# EAGLE design solenoid valve (EAGLE 9.6.2)

## Sheet 1 of 4: photorelay0
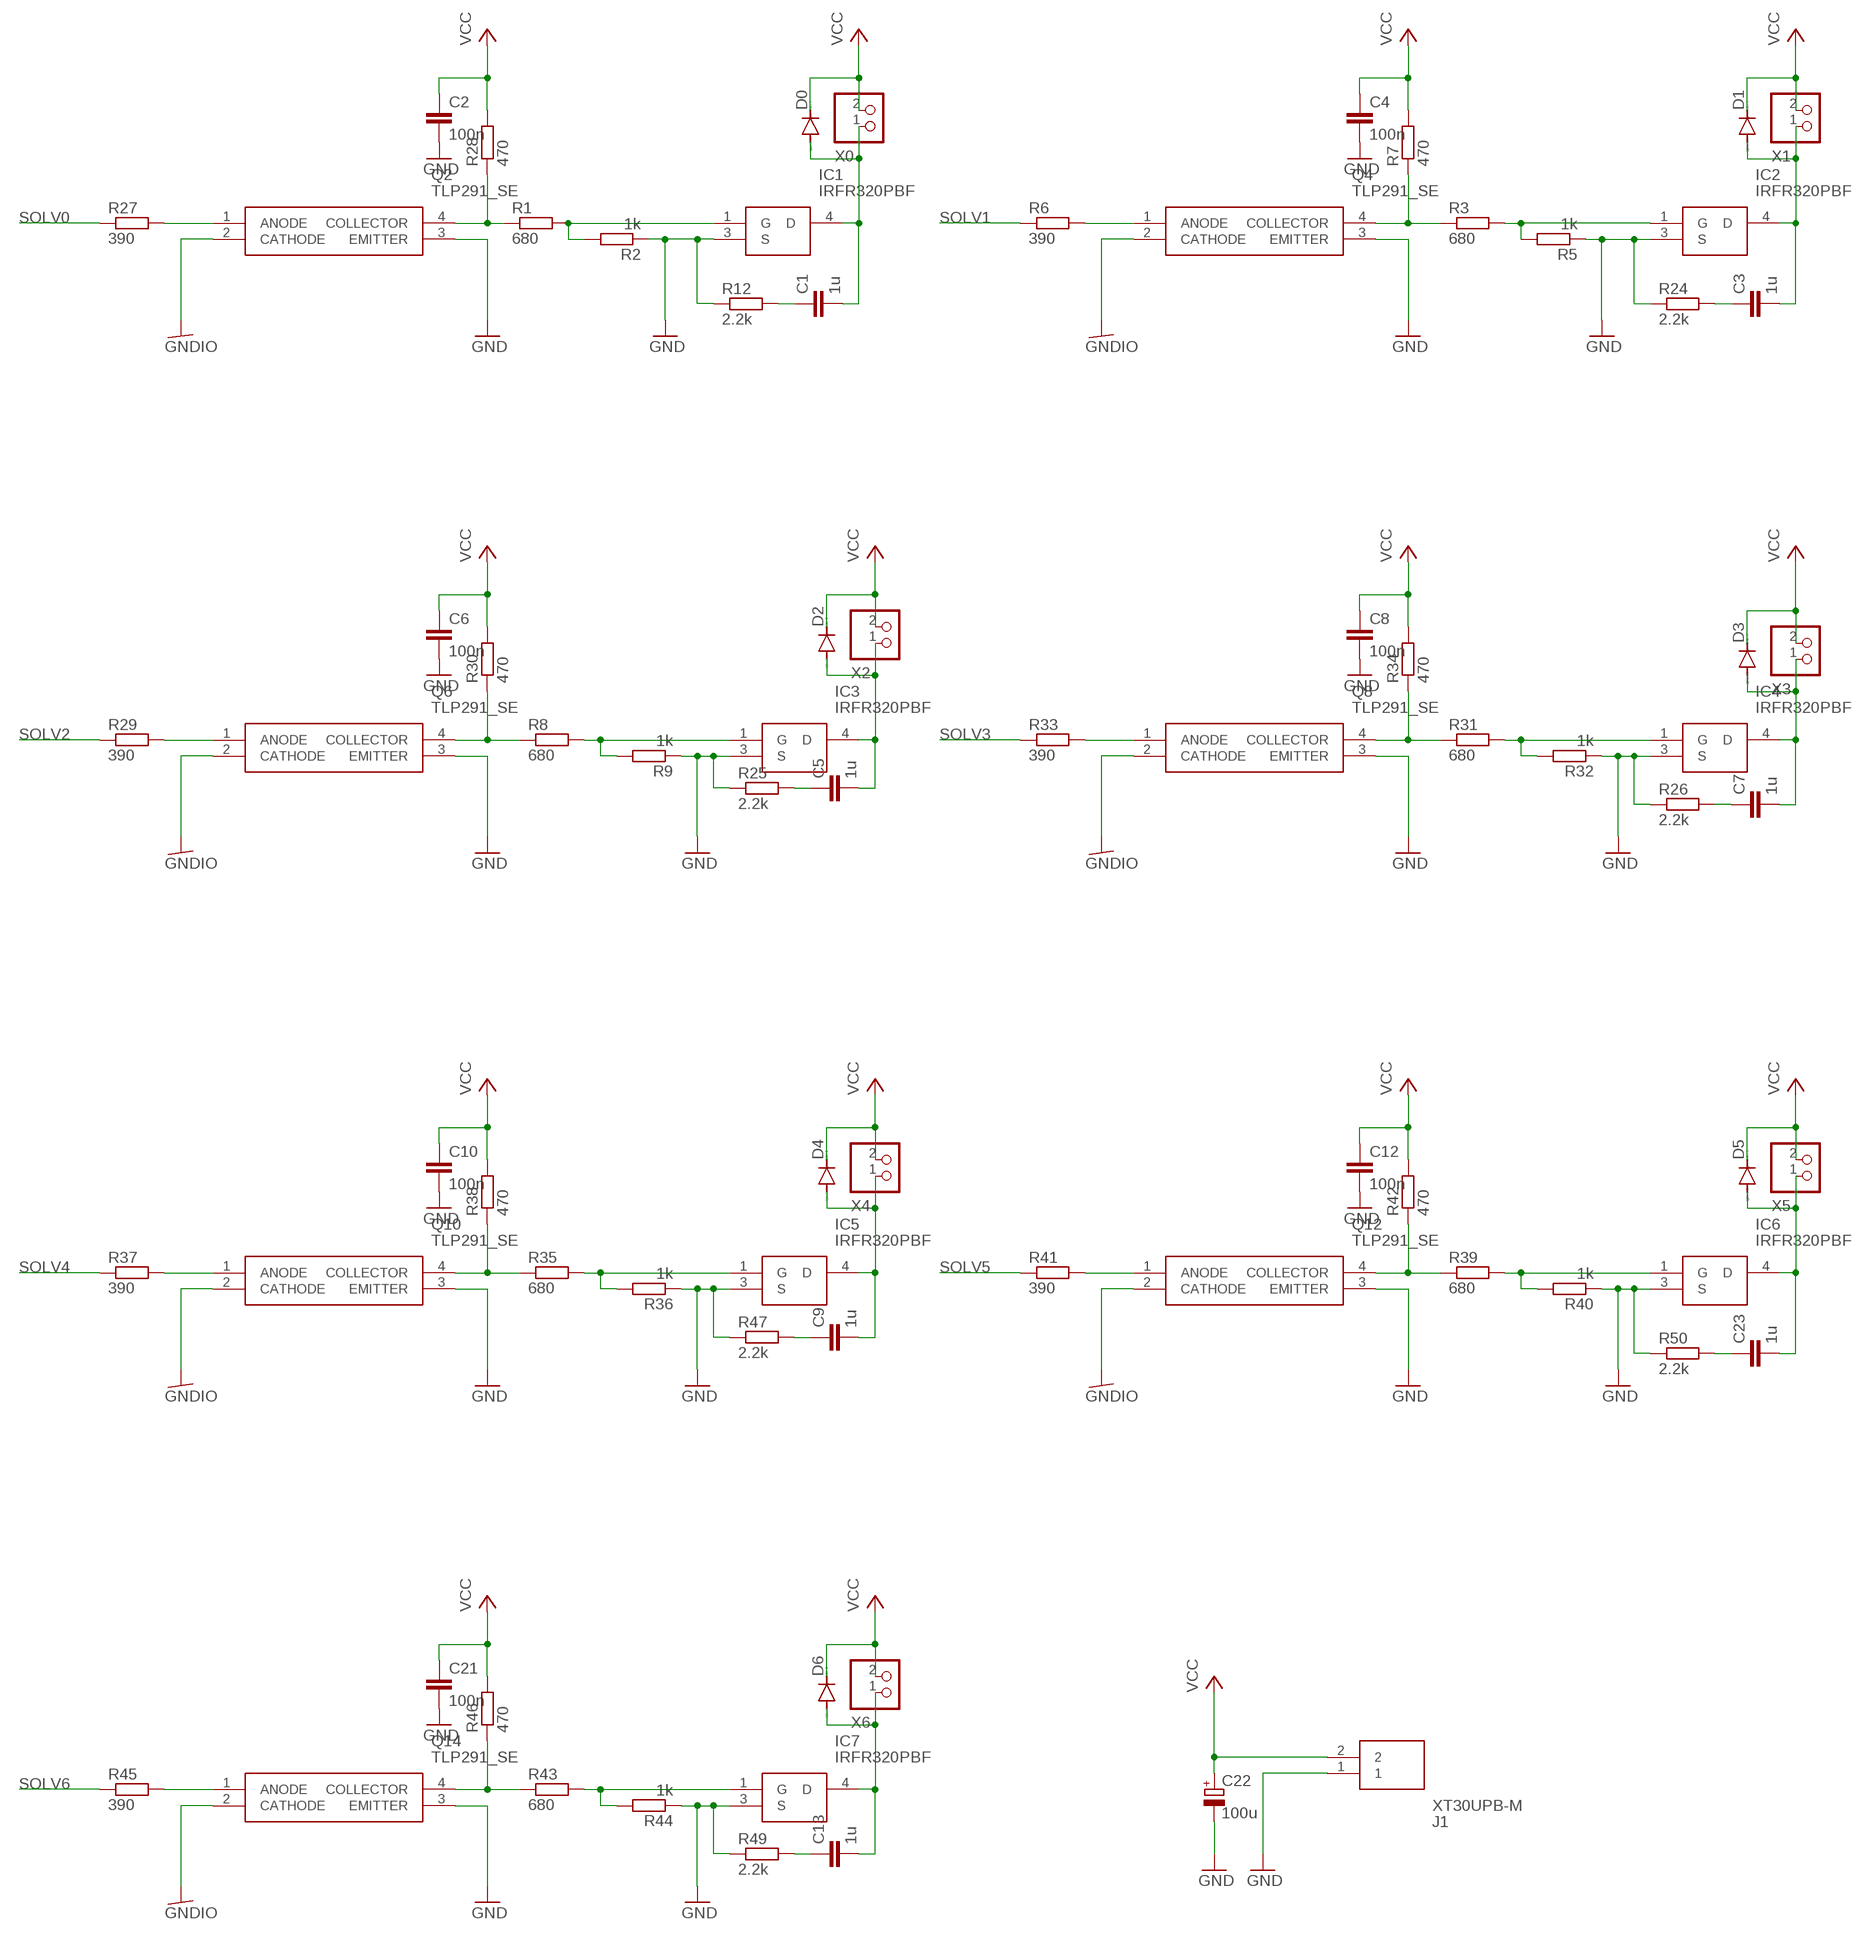
[diagram p0: schematic, sheet 1]

### Parts
C1  1u  C-EUC0603  [C0603]
C2  100n  C-EUC0603  [C0603]
C3  1u  C-EUC0603  [C0603]
C4  100n  C-EUC0603  [C0603]
C5  1u  C-EUC0603  [C0603]
C6  100n  C-EUC0603  [C0603]
C7  1u  C-EUC0603  [C0603]
C8  100n  C-EUC0603  [C0603]
C9  1u  C-EUC0603  [C0603]
C10  100n  C-EUC0603  [C0603]
C12  100n  C-EUC0603  [C0603]
C13  1u  C-EUC0603  [C0603]
C21  100n  C-EUC0603  [C0603]
C22  100u  CPOL-EUE2-5  [E2-5]
C23  1u  C-EUC0603  [C0603]
D0  DIODE-SOD123  [SOD123]
D1  DIODE-SOD123  [SOD123]
D2  DIODE-SOD123  [SOD123]
D3  DIODE-SOD123  [SOD123]
D4  DIODE-SOD123  [SOD123]
D5  DIODE-SOD123  [SOD123]
D6  DIODE-SOD123  [SOD123]
IC1  IRFR320PBF  [TO228P990X238-3N]
IC2  IRFR320PBF  [TO228P990X238-3N]
IC3  IRFR320PBF  [TO228P990X238-3N]
IC4  IRFR320PBF  [TO228P990X238-3N]
IC5  IRFR320PBF  [TO228P990X238-3N]
IC6  IRFR320PBF  [TO228P990X238-3N]
IC7  IRFR320PBF  [TO228P990X238-3N]
J1  XT30UPB-M  [SHDR2W160P0X500_1X2_1020X520X1]
Q2  TLP291_SE  [SOIC127P700X230-4N]
Q4  TLP291_SE  [SOIC127P700X230-4N]
Q6  TLP291_SE  [SOIC127P700X230-4N]
Q8  TLP291_SE  [SOIC127P700X230-4N]
Q10  TLP291_SE  [SOIC127P700X230-4N]
Q12  TLP291_SE  [SOIC127P700X230-4N]
Q14  TLP291_SE  [SOIC127P700X230-4N]
R1  680  R-EU_R0603  [R0603]
R2  1k  R-EU_R0603  [R0603]
R3  680  R-EU_R0603  [R0603]
R5  1k  R-EU_R0603  [R0603]
R6  390  R-EU_R0603  [R0603]
R7  470  R-EU_R0603  [R0603]
R8  680  R-EU_R0603  [R0603]
R9  1k  R-EU_R0603  [R0603]
R12  2.2k  R-EU_R0603  [R0603]
R24  2.2k  R-EU_R0603  [R0603]
R25  2.2k  R-EU_R0603  [R0603]
R26  2.2k  R-EU_R0603  [R0603]
R27  390  R-EU_R0603  [R0603]
R28  470  R-EU_R0603  [R0603]
R29  390  R-EU_R0603  [R0603]
R30  470  R-EU_R0603  [R0603]
R31  680  R-EU_R0603  [R0603]
R32  1k  R-EU_R0603  [R0603]
R33  390  R-EU_R0603  [R0603]
R34  470  R-EU_R0603  [R0603]
R35  680  R-EU_R0603  [R0603]
R36  1k  R-EU_R0603  [R0603]
R37  390  R-EU_R0603  [R0603]
R38  470  R-EU_R0603  [R0603]
R39  680  R-EU_R0603  [R0603]
R40  1k  R-EU_R0603  [R0603]
R41  390  R-EU_R0603  [R0603]
R42  470  R-EU_R0603  [R0603]
R43  680  R-EU_R0603  [R0603]
R44  1k  R-EU_R0603  [R0603]
R45  390  R-EU_R0603  [R0603]
R46  470  R-EU_R0603  [R0603]
R47  2.2k  R-EU_R0603  [R0603]
R49  2.2k  R-EU_R0603  [R0603]
R50  2.2k  R-EU_R0603  [R0603]
X0  S2B-XASK-1  [S2B-XASK-1]
X1  S2B-XASK-1  [S2B-XASK-1]
X2  S2B-XASK-1  [S2B-XASK-1]
X3  S2B-XASK-1  [S2B-XASK-1]
X4  S2B-XASK-1  [S2B-XASK-1]
X5  S2B-XASK-1  [S2B-XASK-1]
X6  S2B-XASK-1  [S2B-XASK-1]

### Nets
GND: C2.2 C4.2 C6.2 C8.2 C10.2 C12.2 C21.2 C22.- IC1.3(S) IC2.3(S) IC3.3(S) IC4.3(S) IC5.3(S) IC6.3(S) IC7.3(S) J1.1 Q2.3(EMITTER) Q4.3(EMITTER) Q6.3(EMITTER) Q8.3(EMITTER) Q10.3(EMITTER) Q12.3(EMITTER) Q14.3(EMITTER) R2.1 R5.1 R9.1 R12.1 R24.1 R25.1 R26.1 R32.1 R36.1 R40.1 R44.1 R47.1 R49.1 R50.1
GNDIO: Q2.2(CATHODE) Q4.2(CATHODE) Q6.2(CATHODE) Q8.2(CATHODE) Q10.2(CATHODE) Q12.2(CATHODE) Q14.2(CATHODE) ; also sheet 2,3,4
N$1: IC2.1(G) R3.2 R5.2
N$2: C3.2 D1.A IC2.4(D) X1.1
N$3: Q2.4(COLLECTOR) R1.1 R28.1
N$4: Q4.1(ANODE) R6.2
N$5: Q4.4(COLLECTOR) R3.1 R7.1
N$6: IC1.1(G) R1.2 R2.2
N$7: C1.2 D0.A IC1.4(D) X0.1
N$8: IC3.1(G) R8.2 R9.2
N$20: Q2.1(ANODE) R27.2
N$23: C5.2 D2.A IC3.4(D) X2.1
N$24: Q6.1(ANODE) R29.2
N$25: Q6.4(COLLECTOR) R8.1 R30.1
N$26: C7.2 D3.A IC4.4(D) X3.1
N$27: C9.2 D4.A IC5.4(D) X4.1
N$28: IC4.1(G) R31.2 R32.2
N$29: C3.1 R24.2
N$30: C23.1 R50.2
N$31: C23.2 D5.A IC6.4(D) X5.1
N$32: C5.1 R25.2
N$33: IC7.1(G) R43.2 R44.2
N$34: Q8.1(ANODE) R33.2
N$35: Q8.4(COLLECTOR) R31.1 R34.1
N$36: IC5.1(G) R35.2 R36.2
N$39: Q10.1(ANODE) R37.2
N$40: Q10.4(COLLECTOR) R35.1 R38.1
N$41: IC6.1(G) R39.2 R40.2
N$43: Q12.1(ANODE) R41.2
N$44: Q12.4(COLLECTOR) R39.1 R42.1
N$46: C13.2 D6.A IC7.4(D) X6.1
N$47: Q14.1(ANODE) R45.2
N$48: Q14.4(COLLECTOR) R43.1 R46.1
N$49: C7.1 R26.2
N$51: C9.1 R47.2
N$55: C13.1 R49.2
N$56: C1.1 R12.2
SOLV0: R27.1 ; also sheet 2
SOLV1: R6.1 ; also sheet 2
SOLV2: R29.1 ; also sheet 2
SOLV3: R33.1 ; also sheet 2
SOLV4: R37.1 ; also sheet 2
SOLV5: R41.1 ; also sheet 2
SOLV6: R45.1 ; also sheet 2
VCC: C2.1 C4.1 C6.1 C8.1 C10.1 C12.1 C21.1 C22.+ D0.C D1.C D2.C D3.C D4.C D5.C D6.C J1.2 R7.2 R28.2 R30.2 R34.2 R38.2 R42.2 R46.2 X0.2 X1.2 X2.2 X3.2 X4.2 X5.2 X6.2

## Sheet 2 of 4: mcu
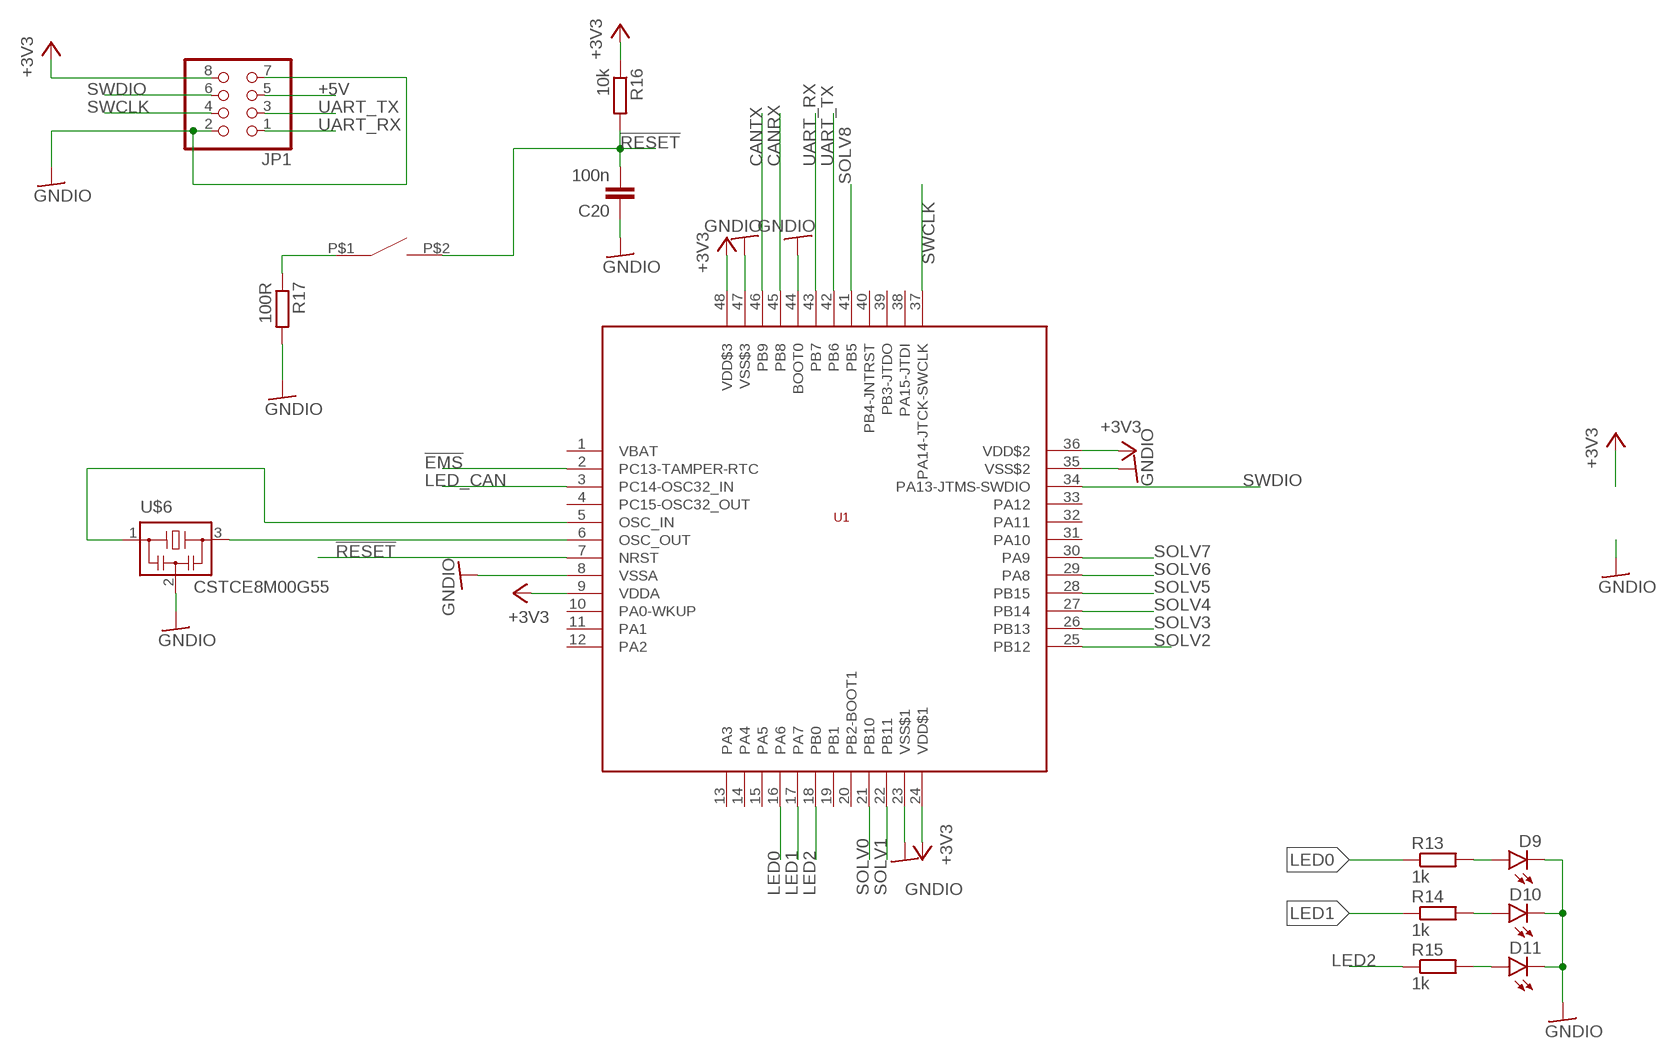
[diagram p1: schematic, sheet 2]

### Parts
C20  100n  C-EUC0603  [C0603]
D9  LEDCHIPLED_0805  [CHIPLED_0805]
D10  LEDCHIPLED_0805  [CHIPLED_0805]
D11  LEDCHIPLED_0805  [CHIPLED_0805]
JP1  PINHD-2X4  [2X04]
R13  1k  R-EU_R0603  [R0603]
R14  1k  R-EU_R0603  [R0603]
R15  1k  R-EU_R0603  [R0603]
R16  10k  R-EU_R0603  [R0603]
R17  100R  R-EU_R0603  [R0603]
SW1  SWITCH_TACTILETOP  [SWITCH_TACTILE_3X6]
U1  STM32F103C8  [LQFP48]
U$6  CSTCE8M00G55  [CSTCE8M00G55]

### Nets
!EMS: U1.2(PC13-TAMPER-RTC) ; also sheet 3
!RESET: C20.2 R16.2 SW1.P$2 U1.7(NRST)
+3V3: JP1.8 R16.1 U1.9(VDDA) U1.24(VDD$1) U1.36(VDD$2) U1.48(VDD$3) ; also sheet 4
+5V: JP1.5 ; also sheet 3,4
CANRX: U1.45(PB8) ; also sheet 3
CANTX: U1.46(PB9) ; also sheet 3
GNDIO: C20.1 D9.C D10.C D11.C JP1.2 JP1.7 R17.2 U1.8(VSSA) U1.23(VSS$1) U1.35(VSS$2) U1.44(BOOT0) U1.47(VSS$3) U$6.2 ; also sheet 1,3,4
LED0: R13.1 U1.16(PA6)
LED1: R14.1 U1.17(PA7)
LED2: R15.1 U1.18(PB0)
LED_CAN: U1.3(PC14-OSC32_IN) ; also sheet 3
N$9: D10.A R14.2
N$10: D9.A R13.2
N$11: U1.6(OSC_OUT) U$6.3
N$16: R17.1 SW1.P$1
N$19: U1.5(OSC_IN) U$6.1
N$21: D11.A R15.2
SOLV0: U1.21(PB10) ; also sheet 1
SOLV1: U1.22(PB11) ; also sheet 1
SOLV2: U1.25(PB12) ; also sheet 1
SOLV3: U1.26(PB13) ; also sheet 1
SOLV4: U1.27(PB14) ; also sheet 1
SOLV5: U1.28(PB15) ; also sheet 1
SOLV6: U1.29(PA8) ; also sheet 1
SOLV7: U1.30(PA9)
SOLV8: U1.41(PB5)
SWCLK: JP1.4 U1.37(PA14-JTCK-SWCLK)
SWDIO: JP1.6 U1.34(PA13-JTMS-SWDIO)
UART_RX: JP1.1 U1.43(PB7)
UART_TX: JP1.3 U1.42(PB6)
Unconnected: U1.1(VBAT) U1.4(PC15-OSC32_OUT) U1.10(PA0-WKUP) U1.11(PA1) U1.12(PA2) U1.13(PA3) U1.14(PA4) U1.15(PA5) U1.19(PB1) U1.20(PB2-BOOT1) U1.31(PA10) U1.32(PA11) U1.33(PA12) U1.38(PA15-JTDI) U1.39(PB3-JTDO) U1.40(PB4-JNTRST)

## Sheet 3 of 4: can
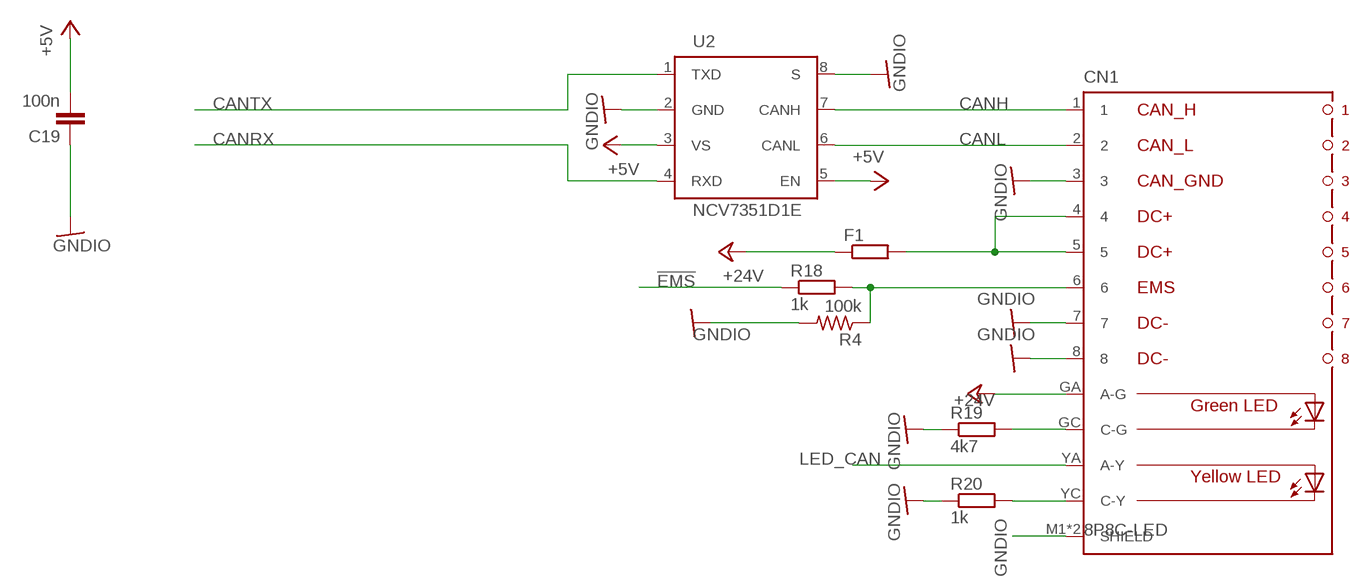
[diagram p2: schematic, sheet 3]

### Parts
C19  100n  C-EUC0603  [C0603]
CN1  8P8C-LED  [8P8C-LED]
F1  R-EU_R1206  [R1206]
R4  100k  R-US_R0603  [R0603]
R18  1k  R-EU_R0603  [R0603]
R19  4k7  R-EU_R0603  [R0603]
R20  1k  R-EU_R0603  [R0603]
U2  NCV7351D1E  [SO08]

### Nets
!EMS: R18.1 ; also sheet 2
+5V: C19.2 U2.3(VS) U2.5(EN) ; also sheet 2,4
+24V: CN1.GA(A-G) F1.1 ; also sheet 4
CANH: CN1.1 U2.7(CANH)
CANL: CN1.2 U2.6(CANL)
CANRX: U2.4(RXD) ; also sheet 2
CANTX: U2.1(TXD) ; also sheet 2
GNDIO: C19.1 CN1.3 CN1.7 CN1.8 CN1.M1(SHIELD) CN1.M2(SHIELD) R4.2 R19.1 R20.1 U2.2(GND) U2.8(S) ; also sheet 1,2,4
LED_CAN: CN1.YA(A-Y) ; also sheet 2
N$12: CN1.4 CN1.5 F1.2
N$18: CN1.YC(C-Y) R20.2
N$22: CN1.GC(C-G) R19.2
N$38: CN1.6 R4.1 R18.2

## Sheet 4 of 4: power suply
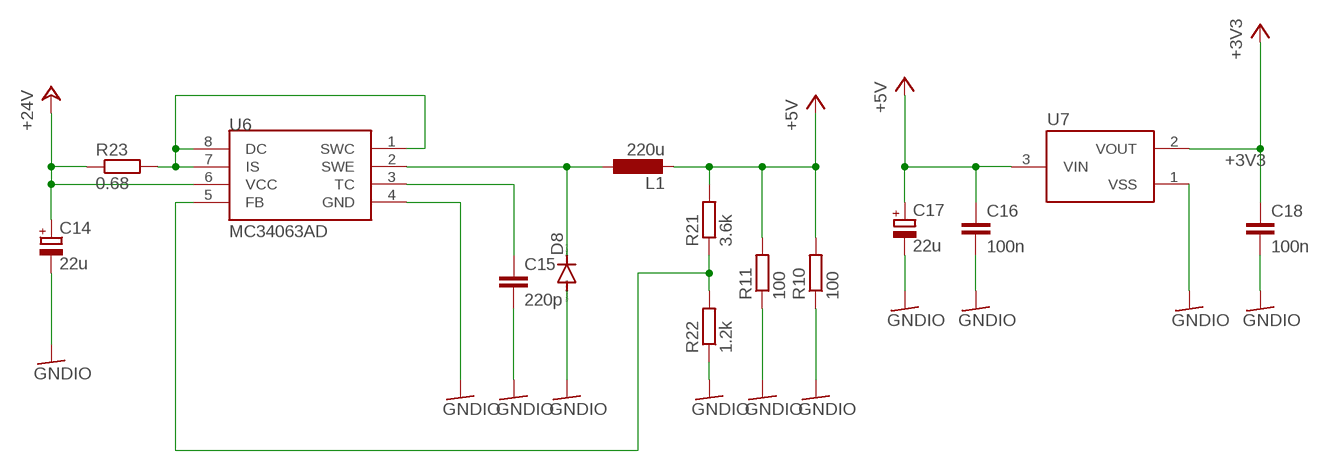
[diagram p3: schematic, sheet 4]

### Parts
C14  22u  CPOL-EUE2-5  [E2-5]
C15  220p  C-EUC0603  [C0603]
C16  100n  C-EUC0603  [C0603]
C17  22u  CPOL-EUE2-5  [E2-5]
C18  100n  C-EUC0603  [C0603]
D8  DIODE-SOD123  [SOD123]
L1  220u  L5852  [L5852]
R10  100  R-EU_R0603  [R0603]
R11  100  R-EU_R0603  [R0603]
R21  3.6k  R-EU_R0603  [R0603]
R22  1.2k  R-EU_R0603  [R0603]
R23  0.68  R-EU_R1206  [R1206]
U6  MC34063AD  [SOIC8]
U7  XC6206  [SOT95P240X110-3]

### Nets
+3V3: C18.1 U7.2(VOUT) ; also sheet 2
+5V: C16.1 C17.+ L1.P$2 R10.2 R11.2 R21.2 U7.3(VIN) ; also sheet 2,3
+24V: C14.+ R23.1 U6.6(VCC) ; also sheet 3
GNDIO: C14.- C15.2 C16.2 C17.- C18.2 D8.A R10.1 R11.1 R22.1 U6.4(GND) U7.1(VSS) ; also sheet 1,2,3
N$13: R23.2 U6.1(SWC) U6.7(IS) U6.8(DC)
N$14: D8.C L1.P$1 U6.2(SWE)
N$15: C15.1 U6.3(TC)
N$17: R21.1 R22.2 U6.5(FB)

## Library data of the parts
C1-C10 C12 C13 C15 C21 C23 = rcl:C-EU: CAPACITOR, European symbol; SPICEPREFIX: C
C14 C17 = rcl:CPOL-EU: POLARIZED CAPACITOR, European symbol
C16 C18-C20 = rcl:C-EU: CAPACITOR, European symbol
C22 = rcl:CPOL-EU: POLARIZED CAPACITOR, European symbol; SPICEPREFIX: C
CN1 = con-rj45:8P8C-LED: generic 8P8C connector with two LED's; OC_FARNELL: unknown; OC_NEWARK: unknown
D0 D1-D6 D8 = diode:DIODE-: DIODE
D9-D11 = led:LED: LED OSRAM: - CHIPLED LG R971, LG N971, LY N971, LG Q971, LY Q971, LO R971, LY R971 LH N974, LH R974 LS Q976, LO Q976, LY Q976 LO Q996 - Hyper CHIPLED LW Q18S LB Q993, LB Q99A, LB R99A - SideLED LS A670, LO A670, LY A670, LG A670, LP A670 LB A673, LV A673, LT A673, LW A673 LH A674 LY A675 LS A676, LA A676, LO A676, LY A676, LW A676 LS A679, LY A679, LG A679 - Hyper Micro SIDELED® LS Y876, LA Y876, LO Y876, LY Y876 LT Y87S - SmartLED LW L88C, LW L88S LB L89C, LB L89S, LG L890 LS L89K, LO L89K, LY L89K LS L896, LA L896, LO L896, LY L896 - TOPLED LS T670, LO T670, LY T670, LG T670, LP T670 LSG T670, LSP T670, LSY T670, LOP T670, LYG T670 LG T671, LOG T671, LSG T671 LB T673, LV T673, LT T673, LW T673 LH T674 LS T676, LA T676, LO T676, LY T676, LB T676, LH T676, LSB T676, LW T676 LB T67C, LV T67C, LT T67C, LS T67K, LO T67K, LY T67K, LW E67C LS E67B, LA E67B, LO E67B, LY E67B, LB E67C, LV E67C, LT E67C LW T67C LS T679, LY T679, LG T679 LS T770, LO T770, LY T770, LG T770, LP T770 LB T773, LV T773, LT T773, LW T773 LH T774 LS E675, LA E675, LY E675, LS T675 LS T776, LA T776, LO T776, LY T776, LB T776 LHGB T686 LT T68C, LB T68C - Hyper Mini TOPLED® LB M676 - Mini TOPLED Santana® LG M470 LS M47K, LO M47K, LY M47K Source: http://www.osram.convergy.de LUXEON: - LUMILED® LXK2-PW12-R00, LXK2-PW12-S00, LXK2-PW14-U00, LXK2-PW14-V00 LXK2-PM12-R00, LXK2-PM12-S00, LXK2-PM14-U00 LXK2-PE12-Q00, LXK2-PE12-R00, LXK2-PE12-S00, LXK2-PE14-T00, LXK2-PE14-U00 LXK2-PB12-K00, LXK2-PB12-L00, LXK2-PB12-M00, LXK2-PB14-N00, LXK2-PB14-P00, LXK2-PB14-Q00 LXK2-PR12-L00, LXK2-PR12-M00, LXK2-PR14-Q00, LXK2-PR14-R00 LXK2-PD12-Q00, LXK2-PD12-R00, LXK2-PD12-S00 LXK2-PH12-R00, LXK2-PH12-S00 LXK2-PL12-P00, LXK2-PL12-Q00, LXK2-PL12-R00 Source: www.luxeon.com KINGBRIGHT: KA-3528ASYC Source: www.kingbright.com
F1 R1-R3 R5-R12 R18-R47 R49 R50 = rcl:R-EU_: RESISTOR, European symbol; SPICEPREFIX: R
IC1-IC7 = SamacSys_Parts:IRFR320PBF: IRFR320PBF, N-channel MOSFET Transistor, 3.1 A 400 V, 3-Pin D-PAK Source: Datasheet <http://www.vishay.com/docs/91273/sihfr320.pdf>; ARROW_PART_NUMBER: IRFR320PBF; ARROW_PRICE-STOCK: https://www.arrow.com/en/products/irfr320pbf/vishay?region=nac; DESCRIPTION: IRFR320PBF, N-channel MOSFET Transistor, 3.1 A 400 V, 3-Pin D-PAK; HEIGHT: mm; MANUFACTURER_NAME: Vishay; MANUFACTURER_PART_NUMBER: IRFR320PBF; MOUSER_PART_NUMBER: 844-IRFR320PBF; MOUSER_PRICE-STOCK: https://www.mouser.co.uk/ProductDetail/Vishay-Semiconductors/IRFR320PBF?qs=iXwvDCb7I7gFL0QusxUOmg%3D%3D
J1 = SamacSys_Parts:XT30UPB-M: Socket; DC supply; XT30; male; PIN: 2; on PCBs; THT; Colour: yellow Source: Datasheet <https://www.tme.eu/Document/4acc913878197f8c2e30d4b8cdc47230/XT30UPB SPEC.pdf>; DESCRIPTION: Socket; DC supply; XT30; male; PIN: 2; on PCBs; THT; Colour: yellow; HEIGHT: 10.7mm; MANUFACTURER_NAME: Amass; MANUFACTURER_PART_NUMBER: XT30UPB-M
JP1 = pinhead:PINHD-2X4: PIN HEADER
L1 = l_ysk:L5852
Q2 Q4 Q6 Q8 Q10 Q12 Q14 = SamacSys_Parts:TLP291_SE: TOSHIBA - TLP291(SE - OPTOCOUPLER, PHOTOTRANS, 3.75KV, SOIC-4 Source: Datasheet <https://toshiba.semicon-storage.com/info/docget.jsp?did=14152&prodName=TLP291(SE>; ARROW_PART_NUMBER: TLP291(SE; ARROW_PRICE-STOCK: https://www.arrow.com/en/products/tlp291-se/toshiba?region=nac; DESCRIPTION: TOSHIBA - TLP291(SE - OPTOCOUPLER, PHOTOTRANS, 3.75KV, SOIC-4; HEIGHT: 2.3mm; MANUFACTURER_NAME: Toshiba; MANUFACTURER_PART_NUMBER: TLP291(SE; MOUSER_PART_NUMBER: 757-TLP291SE; MOUSER_PRICE-STOCK: https://www.mouser.co.uk/ProductDetail/Toshiba/TLP291SE?qs=d%252BuLRCbWxrq6GSE9DY16yA%3D%3D
R4 = rcl:R-US_: RESISTOR, American symbol; SPICEPREFIX: R
R13-R17 = rcl:R-EU_: RESISTOR, European symbol
SW1 = switch-tactile:SWITCH_TACTILE
U1 = stm32_mcu:STM32F103C8: STMicroelectronics STM32F103C8 Mainstream Performance line, ARM Cortex-M3 MCU with 64 Kbytes Flash, 72 MHz CPU, motor control, USB and CAN references: datasheet <https://www.st.com/resource/en/datasheet/stm32f103c8.pdf> product page <https://www.st.com/ja/microcontrollers/stm32f103c8.html>
U2 = on-semi:NCV7351D1E: High Speed CAN Transceiver Source: NCV7351-D.PDF <http://www.onsemi.com/PowerSolutions/document/NCV7351-D.PDF>
U6 = mc34063:MC34063
U7 = torex:XC6206
U$6 = resonator:CSTCE8M00G55
X0 X1-X6 = jst-xa:S2B-XASK-1: Wire-to-Board 2.5mm pitch top mount connector Source: http://www.jst-mfg.com/product/pdf/jpn/XA1.pdf http://www.jst-mfg.com/product/detail.php?series=272

## Board
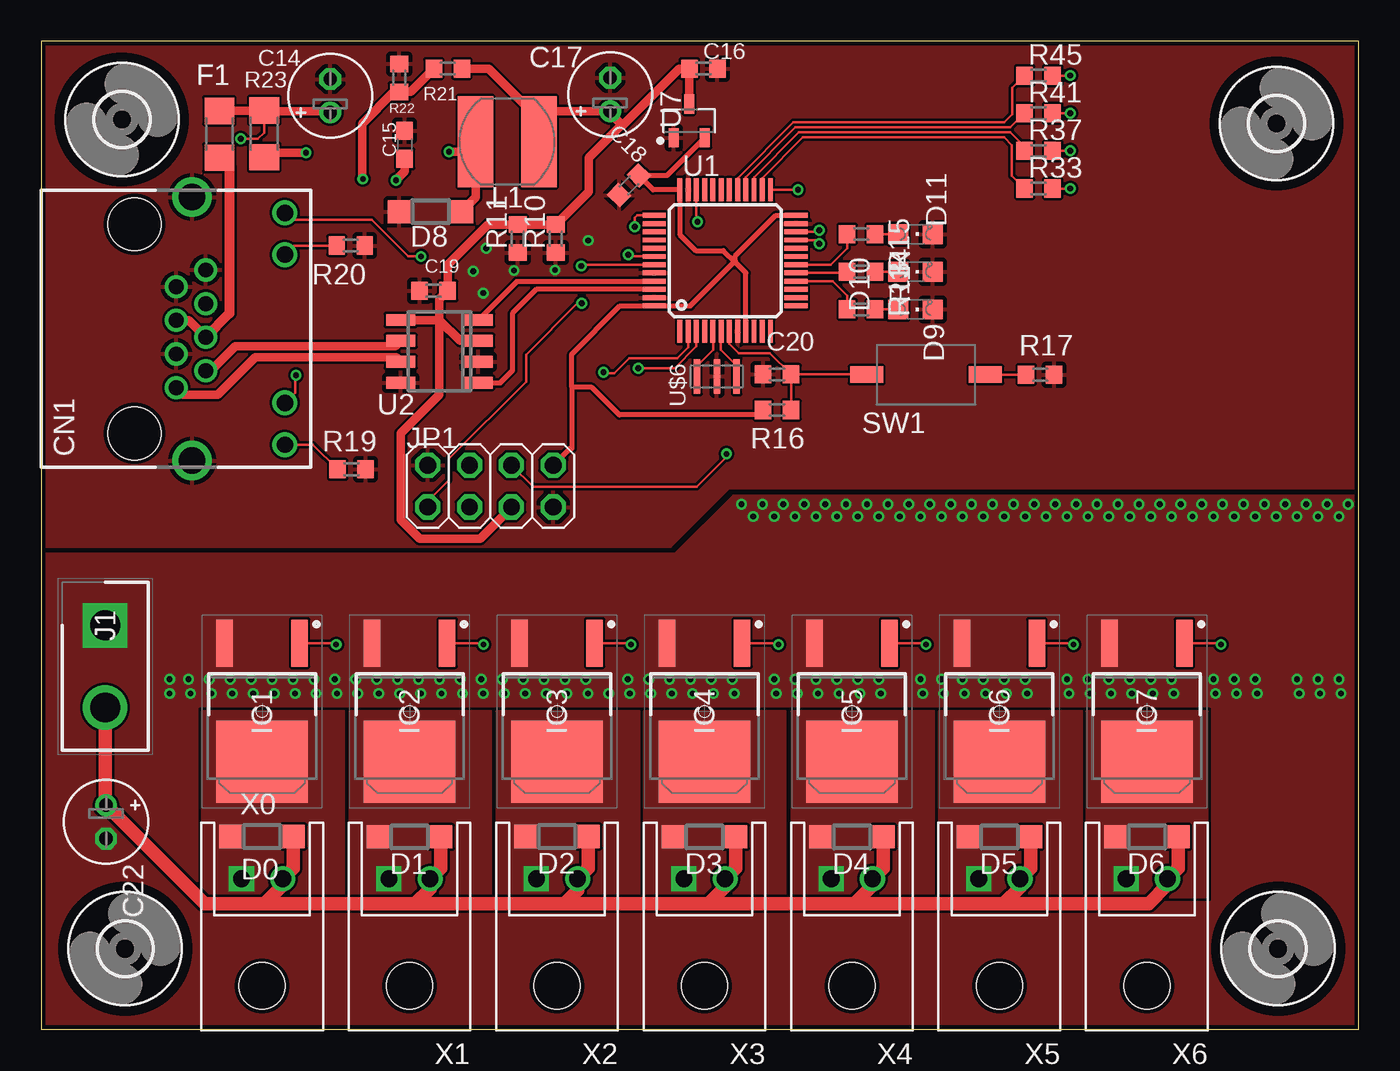
[diagram p4: board, top side]
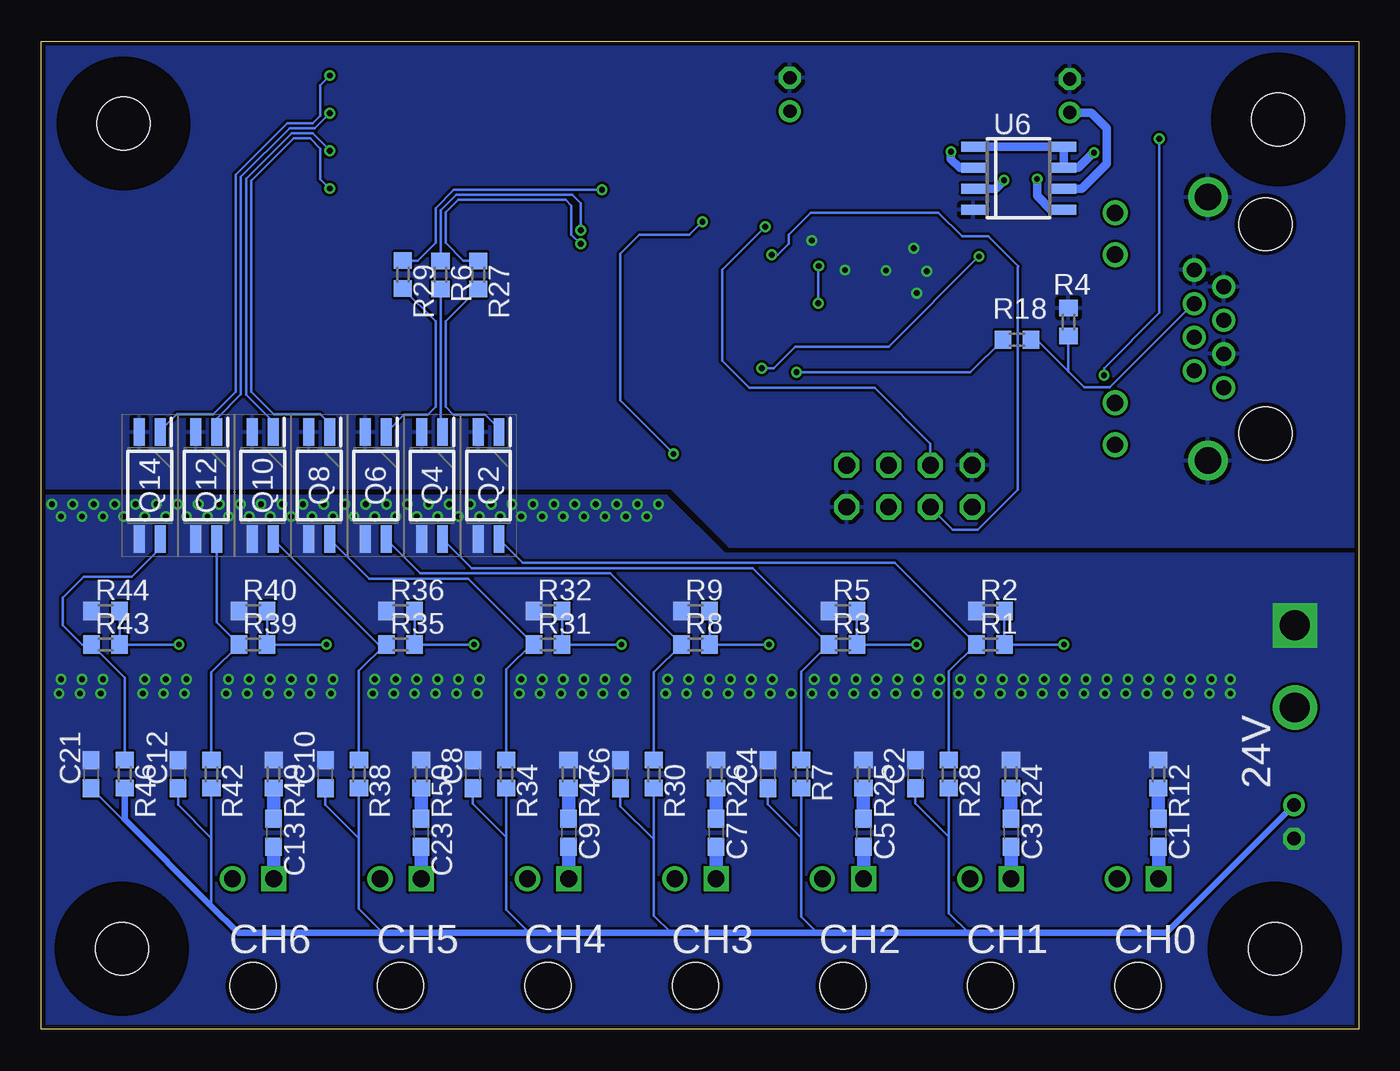
[diagram p5: board, bottom side, seen from below]

Size 80 x 60 mm. Coordinates in mm from the lower left corner, seen from the top.
Outline: 0,0 80,0 80,60 0,60 0,0
Copper layers (1*16): Top 0.035mm / dielectric 1.5mm / Bottom 0.035mm
Design rules "SeeedStudio_2layer_DRU_no_angle_20140221": minimum track width 6mil, minimum drill 12mil, track to track 6mil, track to pad 6mil, pad to pad 6mil, via to via 6mil, smd to smd 0mil, copper to edge 10mil, drill to drill 10mil, minimum pad ring 10mil, minimum via ring 6mil, stop-mask expansion 2mil, vias tented up to drill 100mil, thermal gap 10mil

### Footprints (pad centres in the part's own frame; a part is rotated, then mirrored left to right if it is on the bottom)
C0603 = smd 1.1 x 1: 1 -0.85,0; 2 0.85,0
E2-5 = drill 0.813 pad 1.27: + -1.016,0 | drill 0.813 pad 1.27 octagon: - 1.016,0
C0603' = smd 1 x 1.1: 1 -0.85,0; 2 0.85,0
8P8C-LED = drill 0.9 pad 1.3: 1 3.57,-3.81; 2 2.55,-2.03; 3 1.53,-3.81; 4 0.51,-2.03; 5 -0.51,-3.81; 6 -1.53,-2.03; 7 -2.55,-3.81; 8 -3.57,-2.03 | drill 1 pad 1.422: GA 4.5,2.78; GC 7.04,2.78; YA -7.04,2.78; YC -4.5,2.78 | drill 1.6 pad 2.184: M1 -8,-2.85; M2 8,-2.85 | hole 3.2: 6.35,-6.35; -6.35,-6.35
SOD123 = smd 1.4 x 1.4: A 1.9,0; C -1.9,0
CHIPLED_0805 = smd 1.2 x 1.2: A 0,-1.05; C 0,1.05
R1206 = smd 1.6 x 1.803: 1 -1.422,0; 2 1.422,0
TO228P990X238-3N = smd 2.85 x 1: 1 -4.15,2.28; 3 -4.15,-2.28 | smd 5 x 5.55: 4 3.05,0
SHDR2W160P0X500_1X2_1020X520X1 = drill 1.8 pad 2.7 square: 1 0,0 | drill 1.8 pad 2.7: 2 5,0
2X04 = drill 1.016 octagon: 1 -3.81,-1.27; 2 -3.81,1.27; 3 -1.27,-1.27; 4 -1.27,1.27; 5 1.27,-1.27; 6 1.27,1.27; 7 3.81,-1.27; 8 3.81,1.27
L5852 = smd 2.15 x 5.5: P$1 1.925,0; P$2 -1.925,0
SOIC127P700X230-4N = smd 1.65 x 0.65: 1 -3.25,0.635; 2 -3.25,-0.635; 3 3.25,-0.635; 4 3.25,0.635
R0603 = smd 1 x 1.1: 1 -0.85,0; 2 0.85,0
SWITCH_TACTILE_3X6 = smd 2 x 1: P$1 -3.6,0; P$2 3.6,0
LQFP48 = smd 1.4 x 0.3: 1 -4.3,2.75; 2 -4.3,2.25; 3 -4.3,1.75; 4 -4.3,1.25; 5 -4.3,0.75; 6 -4.3,0.25; 7 -4.3,-0.25; 8 -4.3,-0.75; 9 -4.3,-1.25; 10 -4.3,-1.75; 11 -4.3,-2.25; 12 -4.3,-2.75; 25 4.3,-2.75; 26 4.3,-2.25; 27 4.3,-1.75; 28 4.3,-1.25; 29 4.3,-0.75; 30 4.3,-0.25; 31 4.3,0.25; 32 4.3,0.75; 33 4.3,1.25; 34 4.3,1.75; 35 4.3,2.25; 36 4.3,2.75 | smd 0.3 x 1.4: 13 -2.75,-4.3; 14 -2.25,-4.3; 15 -1.75,-4.3; 16 -1.25,-4.3; 17 -0.75,-4.3; 18 -0.25,-4.3; 19 0.25,-4.3; 20 0.75,-4.3; 21 1.25,-4.3; 22 1.75,-4.3; 23 2.25,-4.3; 24 2.75,-4.3; 37 2.75,4.3; 38 2.25,4.3; 39 1.75,4.3; 40 1.25,4.3; 41 0.75,4.3; 42 0.25,4.3; 43 -0.25,4.3; 44 -0.75,4.3; 45 -1.25,4.3; 46 -1.75,4.3; 47 -2.25,4.3; 48 -2.75,4.3
SO08 = smd 0.72 x 1.78: 1 -1.905,-2.35; 2 -0.635,-2.35; 3 0.635,-2.35; 4 1.905,-2.35; 5 1.905,2.35; 6 0.635,2.35; 7 -0.635,2.35; 8 -1.905,2.35
SOIC8 = smd 0.6 x 1.5: 1 -1.905,-2.75; 2 -0.635,-2.75; 3 0.635,-2.75; 4 1.905,-2.75; 5 1.905,2.75; 6 0.635,2.75; 7 -0.635,2.75; 8 -1.905,2.75
SOT95P240X110-3 = smd 1.18 x 0.609: 1 -1.024,0.95; 2 -1.024,-0.95; 3 1.024,0
3,2 = hole 3.2: 0,0
CSTCE8M00G55 = smd 0.4 x 2.1: 1 -1.2,0; 2 0,0; 3 1.2,0
S2B-XASK-1 = drill 1.016 square: 1 1.25,0 | drill 1.016: 2 -1.25,0 | hole 2.8: 0,6.5

### Placement (x,y rotation side)
C1  12.17,11.94 270 bottom
C2  26.92,15.49 90 bottom
C3  21.12,11.94 270 bottom
C4  35.88,15.49 90 bottom
C5  30.07,11.94 270 bottom
C6  44.83,15.49 90 bottom
C7  39.03,11.94 270 bottom
C8  53.78,15.49 90 bottom
C9  47.98,11.94 270 bottom
C10  62.74,15.49 90 bottom
C12  71.69,15.49 90 bottom
C13  65.89,11.94 270 bottom
C14  17.55,56.69 90 top
C15  22.07,53.71 90 top
C16  100n  [C0603']  40.21,58.34 0 top
C17  34.54,56.76 90 top
C18  100n  [C0603']  35.69,51.25 225 top
C19  100n  [C0603']  23.83,44.85 0 top
C20  100n  [C0603']  44.68,39.77 0 top
C21  76.96,15.49 90 bottom
C22  3.94,12.6 270 top
C23  56.93,11.94 270 bottom
CN1  12.01,42.54 270 top
D0  13.41,11.71 180 top
D1  22.36,11.69 180 top
D2  31.32,11.71 180 top
D3  40.27,11.69 180 top
D4  49.23,11.69 180 top
D5  58.18,11.69 180 top
D6  67.13,11.69 180 top
D8  23.65,49.65 180 top
D9  53.09,43.71 270 top
D10  53.09,46 270 top
D11  53.09,48.29 270 top
F1  10.82,54.35 270 top
IC1  13.41,19.3 270 top
IC2  22.36,19.3 270 top
IC3  31.32,19.3 270 top
IC4  40.27,19.3 270 top
IC5  49.23,19.3 270 top
IC6  58.18,19.3 270 top
IC7  67.13,19.3 270 top
J1  3.89,24.54 270 top
JP1  27.28,32.99 0 top
L1  28.3,53.89 180 top
Q2  52.83,33.02 270 bottom
Q4  56.26,33.02 270 bottom
Q6  59.69,33.02 270 bottom
Q8  63.12,33.02 270 bottom
Q10  66.55,33.02 270 bottom
Q12  69.98,33.02 270 bottom
Q14  73.41,33.02 270 bottom
R1  22.36,23.37 0 bottom
R2  22.36,25.4 0 bottom
R3  31.32,23.37 0 bottom
R4  17.63,42.94 90 bottom
R5  31.32,25.4 0 bottom
R6  55.75,45.81 270 bottom
R7  33.85,15.49 270 bottom
R8  40.27,23.37 0 bottom
R9  40.27,25.4 0 bottom
R10  31.24,48.01 90 top
R11  28.93,48.01 90 top
R12  12.17,15.49 270 bottom
R13  49.78,43.71 0 top
R14  49.78,46 0 top
R15  49.78,48.29 0 top
R16  44.68,37.61 0 top
R17  60.66,39.75 0 top
R18  20.75,41.88 0 bottom
R19  18.85,34 180 top
R20  18.8,47.59 180 top
R21  24.69,58.34 0 top
R22  21.74,57.78 270 top
R23  13.54,54.37 270 top
R24  21.12,15.49 270 bottom
R25  30.07,15.49 270 bottom
R26  39.03,15.49 270 bottom
R27  53.47,45.81 270 bottom
R28  24.89,15.49 270 bottom
R29  58.04,45.82 270 bottom
R30  42.8,15.49 270 bottom
R31  49.23,23.37 0 bottom
R32  49.23,25.4 0 bottom
R33  60.55,51.05 0 top
R34  51.75,15.49 270 bottom
R35  58.18,23.37 0 bottom
R36  58.18,25.4 0 bottom
R37  60.55,53.34 0 top
R38  60.71,15.49 270 bottom
R39  67.13,23.37 0 bottom
R40  67.13,25.4 0 bottom
R41  60.55,55.63 0 top
R42  69.66,15.49 270 bottom
R43  76.09,23.37 0 bottom
R44  76.09,25.4 0 bottom
R45  60.55,57.91 0 top
R46  74.93,15.49 270 bottom
R47  47.98,15.49 270 bottom
R49  65.89,15.49 270 bottom
R50  56.93,15.49 270 bottom
SW1  53.72,39.75 180 top
U1  41.53,46.68 90 top
U2  24.18,41.17 90 top
U6  20.65,51.68 270 bottom
U7  39.34,55.16 90 top
U$1  [3,2]  5.1,4.9 0 top
U$2  [3,2]  4.9,55.24 0 top
U$3  [3,2]  75,55 0 top
U$4  [3,2]  75.1,4.9 0 top
U$6  41.02,39.64 0 top
X0  13.41,9.15 180 top
X1  22.36,9.15 180 top
X2  31.32,9.15 180 top
X3  40.27,9.15 180 top
X4  49.23,9.15 180 top
X5  58.18,9.15 180 top
X6  67.13,9.15 180 top

### Tracks (layer width: path | path; a pad name or v marks a point on that pad's centre or on a via)
!EMS  (via drill 0.35)
  Top 0.152: v34.14,39.9 34.19,39.84 34.8,39.84 35.71,40.76 38.63,40.76 39.28,41.41 U1.2
  Bottom 0.152: v34.14,39.9 23.58,39.9 R18.1
!RESET
  Top 0.152: U1.7 41.78,41.64 42.35,41.06 44.23,41.06 C20.2 | C20.2 R16.2 | C20.2 50.1,39.77 SW1.P$2
+3V3
  Top 0.305: 42.14,46.57 41.42,47.29 39.74,47.29 38.77,48.26 U1.36 37.16,50.98 C18.1 38.01,51.85 U7.2 | 42.14,46.57 42.78,45.94 U1.9 | 42.14,46.66 39.41,43.93 U1.48 35.14,43.93 32.22,41.01 32.22,38.98 | 42.14,46.57 42.14,46.66 | 42.14,46.66 42.14,46.96 44.61,49.43 U1.24 | 32.22,38.98 33.43,38.98 35.1,37.3 43.52,37.3 R16.1 | 32.22,38.98 32.22,35.28 32.12,35.28 JP1.8
+5V
  Top 0.508: R21.2 27.16,58.34 30.22,55.28 L1.P$2 30.22,55.74 C17.+ 34.54,55.61 35.24,54.91 | U2.5 24.17,43.07 | 24.17,43.07 24.17,44.34 C19.2 24.68,46.42 27.11,48.86 R11.2 R10.2 33.25,50.86 33.25,52.93 35.24,54.91 | 24.17,43.07 24.16,43.08 24.16,38.53 21.82,36.19 21.82,30.95 22.99,29.79 26.67,29.79 28.55,31.67 JP1.5 | 24.17,43.07 25.44,41.8 U2.3 | 35.24,54.91 35.27,54.88 38.73,58.34 C16.1 39.36,56.2 U7.3
+24V  (via drill 0.35)
  Top 0.152: R23.1 13.54,54.45 13.16,54.07 v12.12,54.07 | v15.47,39.72 15.42,39.72 15.42,38.66 CN1.GA
  Top 0.508: F1.1 13.51,55.77 R23.1 13.59,55.74 17.48,55.74 C14.+
  Bottom 0.152: v12.12,54.07 12.12,43.5 15.47,40.15 v15.47,39.72
  Bottom 0.508: U6.6 16.81,51.05 15.3,52.56 15.3,54.71 16.26,55.67 C14.+
CANH
  Top 0.508: U2.7 21.55,40.81 12.99,40.81 10.73,38.55 8.62,38.55 CN1.1
CANL
  Top 0.508: CN1.2 10.29,39.99 11.77,41.47 21.5,41.47 U2.6
CANRX
  Top 0.305: U1.45 37.2,45.4 28.86,45.4 U2.4
CANTX
  Top 0.305: U1.46 30.06,44.93 28.61,43.48 28.61,40 27.88,39.26 U2.1
GND  (via drill 0.35)
  other vias: 7.8,21.26 8.94,21.26 10.21,21.26 11.48,21.26 12.75,21.26 14.02,21.26 15.29,21.26 16.56,21.26 17.83,21.26 19.1,21.26 20.37,21.26 21.64,21.26 22.91,21.26 24.18,21.26 25.45,21.26 26.72,21.26 27.99,21.26 29.26,21.26 30.53,21.26 31.8,21.26 33.07,21.26 35.61,21.26 36.88,21.26 38.15,21.26 39.42,21.26 40.69,21.26 41.96,21.26 44.5,21.26 45.77,21.26 47.04,21.26 48.31,21.26 49.58,21.26 50.85,21.26 53.39,21.26 54.66,21.26 55.93,21.26 57.2,21.26 58.47,21.26 59.74,21.26 62.28,21.26 63.55,21.26 64.82,21.26 66.09,21.26 67.36,21.26 68.63,21.26 71.17,21.26 72.44,21.26 73.71,21.26 76.25,21.26 77.52,21.26 78.79,21.26 7.8,20.4 9.07,20.4 10.34,20.4 11.61,20.4 12.88,20.4 14.15,20.4 15.42,20.4 16.69,20.4 17.96,20.4 19.23,20.4 20.5,20.4 21.77,20.4 23.04,20.4 24.31,20.4 25.58,20.4 26.85,20.4 28.12,20.4 29.39,20.4 30.66,20.4 31.93,20.4 33.2,20.4 34.47,20.4 35.74,20.4 37.01,20.4 38.28,20.4 39.55,20.4 40.82,20.4 42.09,20.4 44.63,20.4 45.9,20.4 47.17,20.4 48.44,20.4 49.71,20.4 50.98,20.4 53.52,20.4 54.79,20.4 56.06,20.4 57.33,20.4 58.6,20.4 59.87,20.4 62.41,20.4 63.68,20.4 64.95,20.4 66.22,20.4 67.49,20.4 68.76,20.4 71.3,20.4 72.57,20.4 73.84,20.4 76.38,20.4 42.52,31.88 43.79,31.88 45.06,31.88 46.33,31.88 47.6,31.88 48.87,31.88 50.14,31.88 51.41,31.88 52.68,31.88 53.95,31.88 55.22,31.88 56.49,31.88 57.76,31.88 59.03,31.88 60.3,31.88 61.57,31.88 62.84,31.88 64.11,31.88 65.38,31.88 66.65,31.88 67.92,31.88 69.19,31.88 70.46,31.88 71.73,31.88 73,31.88 74.27,31.88 75.54,31.88 76.81,31.88 78.08,31.88 79.35,31.88 43.23,31.14 44.5,31.14 45.77,31.14 47.04,31.14 48.31,31.14 49.58,31.14 50.85,31.14 52.12,31.14 53.39,31.14 54.66,31.14 55.93,31.14 57.2,31.14 58.47,31.14 59.74,31.14 61.01,31.14 62.28,31.14 63.55,31.14 64.82,31.14 66.09,31.14 67.36,31.14 68.63,31.14 69.9,31.14 71.17,31.14 72.44,31.14 73.71,31.14 74.98,31.14 76.25,31.14 77.52,31.14 78.79,31.14 77.65,20.4 78.92,20.4
  pour Top (rank 3, no thermals): 0,28.87 38.48,28.87 42.01,32.4 80.01,32.4 80.01,0 0,0
  pour Bottom (no thermals): 0,28.87 38.48,28.87 42.01,32.4 80.01,32.4 80.01,0 0,0
  pour Bottom (no thermals): 11.13,17.25 11.13,15.47 13.21,15.47 13.21,17.25
  pour Bottom (no thermals): 20.12,17.27 20.12,15.42 22.17,15.42 22.17,17.27
  pour Bottom (no thermals): 29.18,17.27 29.18,15.49 31.01,15.49 31.11,15.6 31.11,17.27
  pour Bottom (no thermals): 37.97,17.14 37.97,15.52 40.01,15.52 40.01,17.25 38.07,17.25
  pour Bottom (no thermals): 46.96,17.3 46.96,15.42 49,15.42 49,17.3
  pour Bottom (no thermals): 55.98,17.42 55.98,15.39 58.01,15.39 58.01,17.42
  pour Bottom (no thermals): 64.95,17.35 64.95,15.42 66.88,15.42 66.88,17.35
GNDIO  (via drill 0.35)
  other vias: 26.24,46.02 27.03,47.42 26.85,44.7 28.7,46.08 31.19,46.1 33.22,47.9
  pour Top: 80.01,59.99 0,59.99 0,29.3 38.23,29.3 41.78,32.86 80.01,32.86
  pour Bottom: 80.01,59.99 0,59.99 0,29.3 38.23,29.3 41.78,32.86 80.01,32.86
LED0
  Top 0.152: U1.16 48.06,45.43 48.93,44.55 R13.1
LED1
  Top 0.152: U1.17 48.86,45.93 R14.1
LED2
  Top 0.152: U1.18 47.94,46.43 48.93,47.42 R15.1
LED_CAN  (via drill 0.35)
  Top 0.152: CN1.YA 15.23,49.15 20.08,49.15 22.3,46.93 v23.06,46.93 | U1.3 39.78,41.46 38.47,40.15 v36.25,40.15
  Bottom 0.152: v23.06,46.93 28.55,41.44 34.22,41.44 35.51,40.15 v36.25,40.15
N$1  (via drill 0.35)
  Top 0.152: IC2.1 26.77,23.45 v26.86,23.37
  Bottom 0.152: v26.86,23.37 R3.2 R5.2
N$2
  Bottom 0.813: X1.1 C3.2
  pour Top (rank 2, no thermals): 27.3,19.3 18.72,19.3 18.72,8.03 27.3,8.03
N$3
  Bottom 0.152: Q2.4 50.75,28.32 28.17,28.32 23.24,23.39 | 23.24,23.39 R1.1 | R28.1 24.89,21.74 23.24,23.39
N$4
  Bottom 0.152: Q4.1 55.75,36.4 R6.2
N$5
  Bottom 0.152: Q4.4 53.85,27.99 36.79,27.99 R3.1 | R3.1 | R7.1 33.85,21.7 R3.1
N$6  (via drill 0.35)
  Top 0.152: IC1.1 17.82,23.45 v17.91,23.37
  Bottom 0.152: R1.2 | R1.2 v17.91,23.37 | R2.2 R1.2
N$7
  Bottom 0.813: X0.1 C1.2
  pour Top (rank 2, no thermals): 18.36,19.3 9.78,19.3 9.78,8.05 9.75,8.03 18.36,8.03
N$8  (via drill 0.35)
  Top 0.152: IC3.1 35.73,23.45 v35.81,23.37
  Bottom 0.152: v35.81,23.37 R8.2 R9.2
N$9
  Top 0.152: R14.2 D10.A
N$10
  Top 0.152: R13.2 D9.A
N$11
  Top 0.152: U$6.3 42.22,40.3 41.25,41.27 41.25,42.35 U1.6
N$12
  Top 0.508: CN1.4 8.96,43.05 CN1.5
  Top 0.61: F1.2 11.43,52.32 11.43,43.47 CN1.4
N$13  (via drill 0.35)
  Top 0.508: R23.2 13.82,53.23 v16.08,53.23
  Bottom 0.508: v16.08,53.23 16.12,53.23 17.04,52.32 U6.7 U6.8 U6.1
N$14  (via drill 0.35)
  Top 0.508: v24.77,53.28 25.76,53.28 L1.P$1 26.37,50.52 25.55,49.7 D8.C
  Bottom 0.508: v24.77,53.28 24.77,52.84 24.24,52.32 U6.2
N$15  (via drill 0.35)
  Top 0.508: C15.1 22.07,52.09 v21.54,51.55
  Bottom 0.508: U6.3 22.05,51.05 v21.54,51.55
N$16
  Top 0.152: SW1.P$1 R17.1
N$17  (via drill 0.35)
  Top 0.508: R21.1 22.43,56.93 R22.2 21.41,56.93 19.48,55 19.48,51.68 v19.53,51.63
  Bottom 0.508: U6.5 18.69,49.78 19.53,50.62 v19.53,51.63
N$18
  Top 0.152: CN1.YC 15.35,47.59 R20.2
N$19
  Top 0.152: U$6.1 39.82,40.3 40.79,41.27 40.79,42.36 U1.5
N$20
  Bottom 0.152: R27.2 55.45,42.98 55.45,37.8 54.98,37.32 53.05,37.32 52.2,36.47 Q2.1
N$21
  Top 0.152: R15.2 D11.A
N$22
  Top 0.152: R19.2 16.5,35.5 CN1.GC
N$23
  Bottom 0.813: X2.1 C5.2
  pour Top (rank 2, no thermals): 36.32,19.3 27.66,19.3 27.66,8.03 36.32,8.03
N$24
  Bottom 0.152: R29.2 56.06,42.99 56.06,37.8 56.53,37.32 57.98,37.32 59.03,36.27 Q6.1
N$25
  Bottom 0.152: Q6.4 56.97,27.69 45.44,27.69 R8.1 42.8,21.69 R30.1
N$26
  Bottom 0.813: X3.1 C7.2
  pour Top (rank 2, no thermals): 45.19,19.3 36.63,19.3 36.63,8.03 45.19,8.03
N$27
  Bottom 0.813: X4.1 C9.2
  pour Top (rank 2, no thermals): 54.18,19.3 45.57,19.3 45.57,8.03 54.18,8.03
N$28  (via drill 0.35)
  Top 0.152: IC4.1 44.68,23.45 v44.77,23.37
  Bottom 0.152: v44.77,23.37 R31.2 R32.2
N$29
  Bottom 0.813: C3.1 R24.2
N$30
  Bottom 0.813: C23.1 R50.2
N$31
  Bottom 0.813: X5.1 C23.2
  pour Top (rank 2, no thermals): 63.17,19.3 54.53,19.3 54.53,8.03 63.17,8.03
N$32
  Bottom 0.813: C5.1 R25.2
N$33  (via drill 0.35)
  Top 0.152: IC7.1 71.54,23.45 v71.63,23.37
  Bottom 0.152: v71.63,23.37 R43.2 R44.2
N$34  (via drill 0.35)
  Top 0.152: R33.2 v62.48,51.05
  Bottom 0.152: v62.48,51.05 63.04,51.61 63.04,53.47 63.68,54.1 64.67,54.1 67.26,51.51 67.26,38.71 65.89,37.34 63.04,37.34 62.48,36.78 Q8.1
N$35
  Bottom 0.152: 50.16,23.45 54.06,27.36 60.07,27.36 Q8.4 | 50.16,23.45 R31.1 | R34.1 51.75,21.86 50.16,23.45
N$36  (via drill 0.35)
  Top 0.152: IC5.1 53.63,23.45 v53.72,23.37
  Bottom 0.152: R35.2 57.3,23.37 | 57.3,23.37 v53.72,23.37 | R36.2 57.33,23.39 57.3,23.37
N$38
  Bottom 0.152: CN1.6 10.06,44.07 15.13,39 16.68,39 17.63,39.95 | R18.2 19.56,41.88 17.63,39.95 | R4.1 17.63,39.95
N$39  (via drill 0.35)
  Top 0.152: R37.2 v62.48,53.34
  Bottom 0.152: v62.48,53.34 62.48,53.37 63.52,54.41 64.8,54.41 67.56,51.64 67.56,38.53 65.91,36.88 Q10.1
N$40
  Bottom 0.152: Q10.4 59.51,23.37 59.11,23.37 | 59.11,23.37 R35.1 | R38.1 60.71,21.77 59.11,23.37
N$41  (via drill 0.35)
  Top 0.152: IC6.1 62.59,23.45 v62.67,23.37
  Bottom 0.152: v62.67,23.37 R39.2 R40.2
N$43  (via drill 0.35)
  Top 0.152: R41.2 v62.48,55.63
  Bottom 0.152: v62.48,55.63 63.4,54.71 64.92,54.71 67.87,51.76 67.87,38.56 69.34,37.08 Q12.1
N$44
  Bottom 0.152: Q12.4 69.34,24.73 R39.1 69.66,21.69 R42.1
N$46
  Bottom 0.813: X6.1 C13.2
  pour Top (rank 2, no thermals): 67.13,19.3 63.47,19.3 63.47,8.03 70.79,8.03 70.79,19.3
N$47  (via drill 0.35)
  Top 0.152: R45.2 v62.48,57.91
  Bottom 0.152: v62.48,57.91 63.07,57.33 63.07,55.47 63.52,55.02 65.05,55.02 68.17,51.89 68.17,38.71 69.55,37.34 71.78,37.34 72.77,36.35 Q14.1
N$48
  Bottom 0.152: Q14.4 72.77,29.21 74.5,27.48 77.42,27.48 78.69,26.21 78.69,24.54 77.52,23.37 R43.1 74.93,21.36 R46.1
N$49
  Bottom 0.813: C7.1 R26.2
N$51
  Bottom 0.813: C9.1 R47.2
N$55
  Bottom 0.813: C13.1 R49.2
N$56
  Bottom 0.813: C1.1 R12.2
SOLV0  (via drill 0.35)
  Top 0.152: U1.21 47.02,47.93 v47.24,47.7
  Bottom 0.152: v47.24,47.7 47.8,48.26 47.8,50.01 48.16,50.37 54.69,50.37 55.45,49.61 55.45,47.75 54.36,46.66 R27.1
SOLV1  (via drill 0.35)
  Top 0.152: v47.24,48.51 47.16,48.43 U1.22
  Bottom 0.152: v47.24,48.51 47.24,50.16 47.75,50.67 54.81,50.67 55.75,49.73 R6.1
SOLV2  (via drill 0.35)
  Top 0.152: U1.25 v45.95,50.98
  Bottom 0.152: v45.95,50.98 54.94,50.98 56.06,49.86 56.06,47.75 57.14,46.67 R29.1
SOLV3
  Top 0.152: U1.26 43.78,51.68 46.25,54.15 58.47,54.15 58.93,53.7 58.93,51.83 R33.1
SOLV4
  Top 0.152: U1.27 43.28,51.74 46,54.46 58.84,54.46 59.7,53.59 R37.1
SOLV5
  Top 0.152: U1.28 42.78,51.74 45.8,54.76 58.84,54.76 R41.1
SOLV6
  Top 0.152: U1.29 42.28,51.68 45.67,55.07 58.47,55.07 58.95,55.55 58.95,57.16 R45.1
SWCLK  (via drill 0.35)
  Top 0.152: v36.04,48.73 36.04,49.27 36.2,49.43 U1.37
  Bottom 0.152: v36.04,48.73 38.66,46.12 38.66,40.6 37.01,38.96 29.4,38.96 26.01,35.57 JP1.4
SWDIO  (via drill 0.35)
  Top 0.152: U1.34 39.78,49.12 v39.85,49.04 | v41.6,34.94 41.6,34.74 39.8,32.94 29.87,32.94 JP1.6
  Bottom 0.152: v39.85,49.04 40.64,48.25 43.69,48.25 44.86,47.08 44.86,38.19 v41.6,34.94
UART_RX  (via drill 0.35)
  Top 0.152: U1.43 32.85,46.43 32.79,46.37 v32.79,46.35 | v32.82,44.09 32.56,44.09 29.44,40.96 29.44,39.34 24.74,34.64 24.74,33.34 23.47,32.07 JP1.1
  Bottom 0.152: v32.79,46.35 32.82,46.32 v32.82,44.09
UART_TX  (via drill 0.35)
  Top 0.152: v35.64,47.03 35.76,47.03 35.87,46.93 U1.42
  Bottom 0.152: v35.64,47.03 35.28,47.03 34.62,47.69 34.62,48.25 33.28,49.59 25.53,49.59 24.09,48.16 22.51,48.16 20.68,46.32 20.72,46.28 20.72,32.76 23.14,30.34 24.66,30.34 26.01,31.69 JP1.3
VCC
  Top 0.813: J1.2 3.89,13.66 C22.+ 9.93,7.62 13.54,7.62 | D0.C 15.31,9.8 X0.2 14.66,8.74 13.54,7.62 | D1.C 24.27,9.8 X1.2 23.61,8.55 22.68,7.62 | D2.C 33.22,9.8 X2.2 32.57,8.44 31.75,7.62 | D3.C 42.17,9.8 X3.2 41.52,8.65 40.49,7.62 | D4.C 51.12,9.8 X4.2 50.48,8.74 49.35,7.62 | D5.C 60.08,9.8 X5.2 59.43,8.63 58.42,7.62 | D6.C 69.03,9.8 X6.2 68.38,8.77 67.23,7.62 58.42,7.62 | 13.54,7.62 22.68,7.62 | 22.68,7.62 31.75,7.62 | 31.75,7.62 40.49,7.62 | 40.49,7.62 49.35,7.62 | 49.35,7.62 58.42,7.62
  Bottom 0.152: R28.2 24.89,11.71 | 24.89,11.71 24.89,7.06 23.7,5.87 | R7.2 33.85,11.63 | 33.85,11.63 33.85,6.84 32.87,5.87 | R30.2 42.8,11.53 | 42.8,11.53 42.8,6.91 41.76,5.87 | R34.2 51.75,11.66 | 51.75,11.66 51.75,7.25 50.37,5.87 | R38.2 60.71,11.61 | 60.71,11.61 60.71,7.32 59.26,5.87 | R42.2 69.66,11.61 | 69.66,11.61 69.66,7.56 69.7,7.52 | 24.89,11.71 26.92,13.74 C2.1 | 33.85,11.63 35.88,13.66 C4.1 | 42.8,11.53 44.83,13.56 C6.1 | 51.75,11.66 53.78,13.69 C8.1 | 60.71,11.61 62.74,13.64 C10.1 | 69.66,11.61 71.69,13.64 C12.1 | 74.93,12.75 75.07,12.75 C21.1
  Bottom 0.406: C22.+ 11.68,5.87 23.7,5.87 32.87,5.87 41.76,5.87 50.37,5.87 59.26,5.87 68.05,5.87 69.7,7.52 74.93,12.75 R46.2

### Text on the board
bPlace: 24V | CH0 | CH1 | CH2 | CH3 | CH4 | CH5 | CH6